# EAGLE design cheater-hdmi (EAGLE 7.5.0)
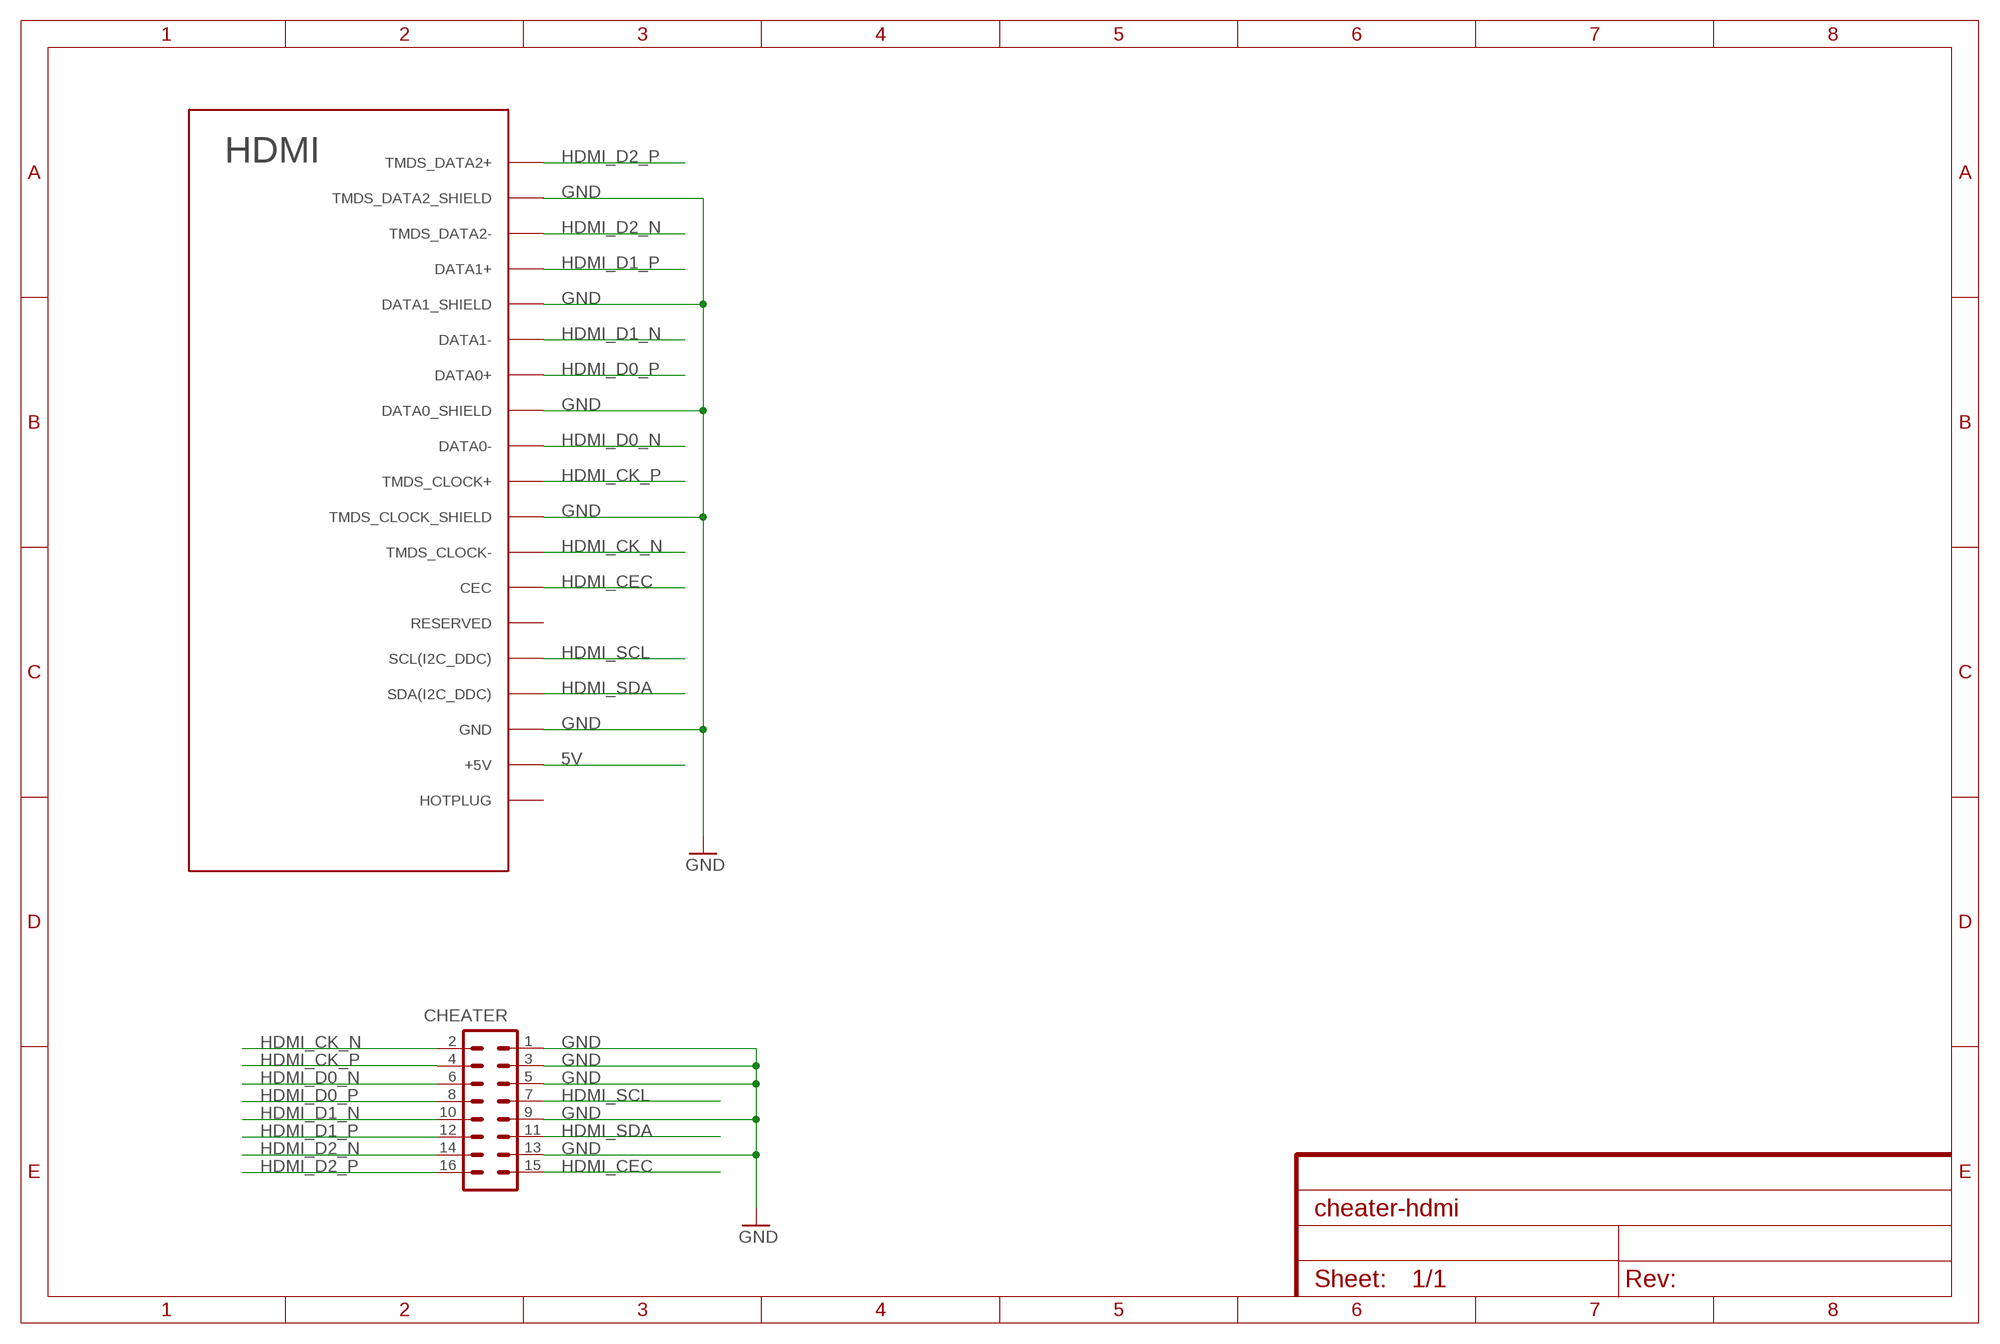
[diagram p0: schematic, sheet 1]

## Parts
CHEATER  M08X2  [2X8]
U$1  HDMI  [HDMI]

## Nets
5V: U$1.P$2(+5V)
GND: CHEATER.1 CHEATER.3 CHEATER.5 CHEATER.9 CHEATER.13 U$1.P$3(GND) U$1.P$9(TMDS_CLOCK_SHIELD) U$1.P$12(DATA0_SHIELD) U$1.P$15(DATA1_SHIELD) U$1.P$18(TMDS_DATA2_SHIELD)
HDMI_CEC: CHEATER.15 U$1.P$7(CEC)
HDMI_CK_N: CHEATER.2 U$1.P$8(TMDS_CLOCK-)
HDMI_CK_P: CHEATER.4 U$1.P$10(TMDS_CLOCK+)
HDMI_D0_N: CHEATER.6 U$1.P$11(DATA0-)
HDMI_D0_P: CHEATER.8 U$1.P$13(DATA0+)
HDMI_D1_N: CHEATER.10 U$1.P$14(DATA1-)
HDMI_D1_P: CHEATER.12 U$1.P$16(DATA1+)
HDMI_D2_N: CHEATER.14 U$1.P$17(TMDS_DATA2-)
HDMI_D2_P: CHEATER.16 U$1.P$19(TMDS_DATA2+)
HDMI_SCL: CHEATER.7 U$1.P$5(SCL(I2C_DDC))
HDMI_SDA: CHEATER.11 U$1.P$4(SDA(I2C_DDC))
Unconnected: U$1.P$1(HOTPLUG) U$1.P$6(RESERVED)

## Library data of the parts
CHEATER = SparkFun-Connectors:M08X2: .1" headers, two rows of 8 each
U$1 = 00_cody:HDMI

## Board
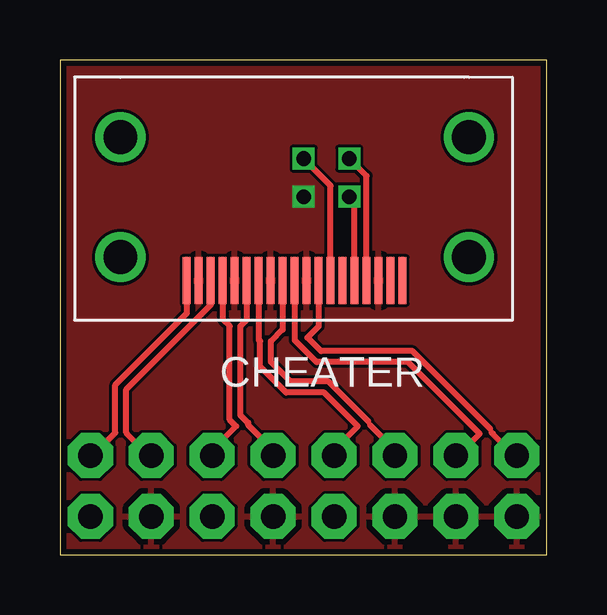
[diagram p1: board, top side]
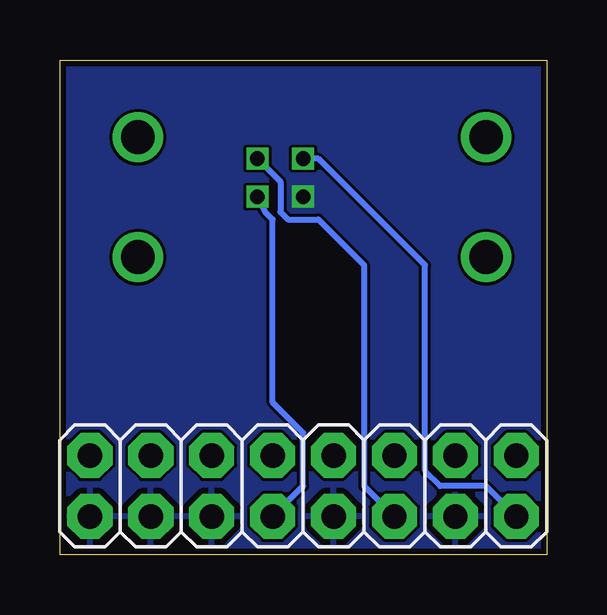
[diagram p2: board, bottom side, seen from below]

Size 20.3 x 20.62 mm. Coordinates in mm from the lower left corner, seen from the top.
Outline: 0,0 20.3,0 20.3,20.62 0,20.62 0,0
Copper layers (1*16): Top 0.035mm / dielectric 1.5mm / Bottom 0.035mm
Design rules "dirtypcbs": minimum track width 5mil, minimum drill 12mil, track to track 5mil, track to pad 5mil, pad to pad 5mil, via to via 5mil, smd to smd 0mil, copper to edge 10mil, drill to drill 10mil, minimum pad ring 10mil, minimum via ring 6mil, stop-mask expansion 2mil, vias tented up to drill 25mil, thermal gap 10mil

### Footprints (pad centres in the part's own frame; a part is rotated, then mirrored left to right if it is on the bottom)
2X8 = drill 1.016 pad 1.88 octagon: 1 0,0; 2 0,2.54; 3 2.54,0; 4 2.54,2.54; 5 5.08,0; 6 5.08,2.54; 7 7.62,0; 8 7.62,2.54; 9 10.16,0; 10 10.16,2.54; 11 12.7,0; 12 12.7,2.54; 13 15.24,0; 14 15.24,2.54; 15 17.78,0; 16 17.78,2.54
HDMI = smd 0.33 x 1.95: P$1 0,0; P$2 0.5,0; P$3 1,0; P$4 1.5,0; P$5 2,0; P$6 2.5,0; P$7 3,0; P$8 3.5,0; P$9 4,0; P$10 4.5,0; P$11 5,0; P$12 5.5,0; P$13 6,0; P$14 6.5,0; P$15 7,0; P$16 7.5,0; P$17 8,0; P$18 8.5,0; P$19 9,0 | drill 1.4: P$20 -2.765,-0.975; P$21 -2.765,-5.975; P$22 11.765,-5.975; P$23 11.765,-0.975

### Placement (x,y rotation side)
CHEATER  19.05,1.59 0 bottom
U$1  14.29,11.43 180 top

### Tracks (layer width: path | path; a pad name or v marks a point on that pad's centre or on a via)
GND  (via drill 0.61)
  other vias: 10.16,14.92
  pour Top: 0,20.64 0,0 20.32,0 20.32,20.64
  pour Bottom: 0,20.64 20.32,20.64 20.32,0 0,0
HDMI_CEC  (via drill 0.61)
  Top 0.254: v10.16,16.51 11.29,15.38 U$1.P$7
  Bottom 0.254: CHEATER.15 2.54,2.86 4.45,2.86 5.08,3.49 5.08,12.06 9.53,16.51 v10.16,16.51
HDMI_CK_N
  Top 0.127: 17.94,5.24 17.94,5.15 18.05,5.04
  Top 0.254: CHEATER.2 18.96,4.13 18.05,5.04 18.01,5.08 | 17.94,5.24 14.7,8.48 10.89,8.48 10.32,9.05 10.79,9.52 U$1.P$8
HDMI_CK_P
  Top 0.254: CHEATER.4 16.6,4.13 17.5,5.03 14.51,8.03 10.7,8.03 9.79,8.94 U$1.P$10
HDMI_D0_N
  Top 0.127: 12.86,5.56 12.86,5.46 12.93,5.4
  Top 0.254: CHEATER.6 13.97,4.36 12.93,5.4 | 12.86,5.56 11.21,7.21 9.62,7.21 8.8,8.03 8.8,8.89 9.29,9.38 U$1.P$11
HDMI_D0_P
  Top 0.254: CHEATER.8 11.43,4.36 12.42,5.35 11.02,6.76 9.43,6.76 8.34,7.84 8.34,8.89 8.29,8.95 U$1.P$13
HDMI_D1_N
  Top 0.254: CHEATER.10 8.89,4.36 7.85,5.4 7.85,5.49 7.53,5.81 7.53,9.53 7.79,9.78 U$1.P$14
HDMI_D1_P
  Top 0.254: CHEATER.12 6.35,4.36 7.34,5.35 7.07,5.62 7.07,9.53 6.79,9.81 U$1.P$16
HDMI_D2_N
  Top 0.254: CHEATER.14 3.72,4.13 2.77,5.08 2.77,6.89 6.29,10.41 U$1.P$17
HDMI_D2_P
  Top 0.254: CHEATER.16 1.36,4.13 2.31,5.08 2.31,7.08 5.29,10.06 U$1.P$19
HDMI_SCL  (via drill 0.61)
  Top 0.254: U$1.P$5 12.29,14.7 v12.06,14.92
  Bottom 0.254: CHEATER.7 10.16,2.86 10.16,5.08 11.43,6.35 11.43,13.97 11.75,14.29 v12.06,14.92
HDMI_SDA  (via drill 0.61)
  Top 0.254: U$1.P$4 12.79,15.79 v12.06,16.51
  Bottom 0.254: v12.06,16.51 11.11,15.56 11.11,14.29 10.79,13.97 9.53,13.97 7.62,12.06 7.62,2.86 CHEATER.11